# Altium schematic sheet Eurorack_cabletester.schdoc
size 291 x 166 mm
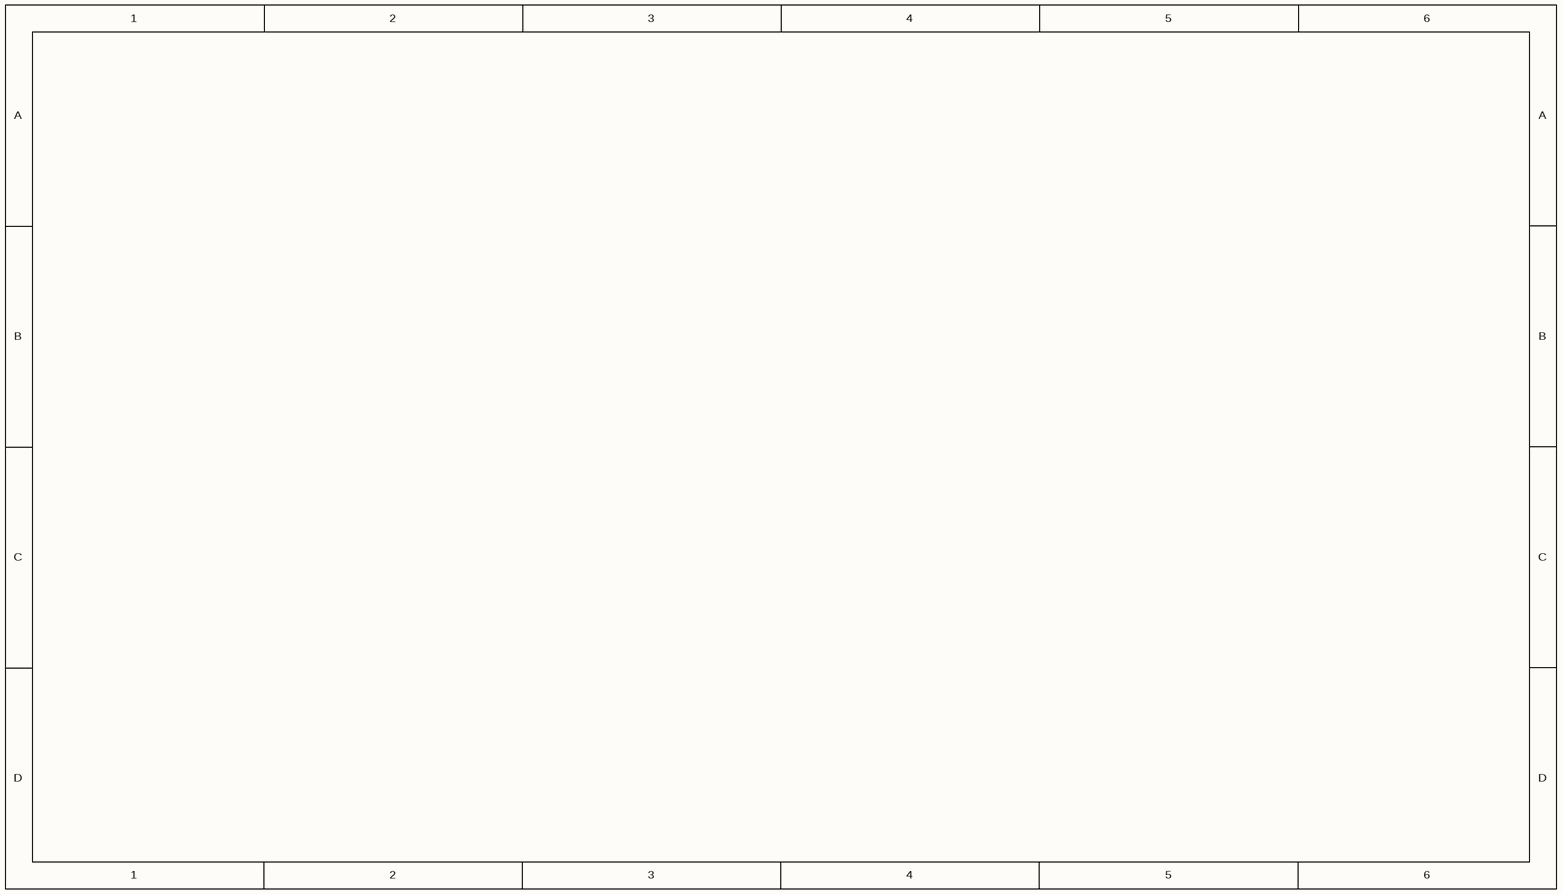
[diagram p0: Eurorack_cabletester.schdoc]

## Parts
C1  100nF  [CAP-TH_L5.0-W2.5-P2.54-D0.7]
CN1  901301116  [CONN-TH_901301116]
CN2  901301116  [CONN-TH_901301116]
R1  1K  [RES-TH_BD2.4-L6.3-P10.30-D0.6]
R2  1K  [RES-TH_BD2.4-L6.3-P10.30-D0.6]
R3  1K  [RES-TH_BD2.4-L6.3-P10.30-D0.6]
R4  1K  [RES-TH_BD2.4-L6.3-P10.30-D0.6]
R5  1K  [RES-TH_BD2.4-L6.3-P10.30-D0.6]
R6  1K  [RES-TH_BD2.4-L6.3-P10.30-D0.6]
R7  1K  [RES-TH_BD2.4-L6.3-P10.30-D0.6]
R8  1K  [RES-TH_BD2.4-L6.3-P10.30-D0.6]
R9  1K  [RES-TH_BD2.4-L6.3-P10.30-D0.6]
R10  10K  [RES-TH_BD2.4-L6.3-P10.30-D0.6]
R11  10K  [RES-TH_BD2.4-L6.3-P10.30-D0.6]
R12  10K  [RES-TH_BD2.4-L6.3-P10.30-D0.6]
R13  10K  [RES-TH_BD2.4-L6.3-P10.30-D0.6]
R14  10K  [RES-TH_BD2.4-L6.3-P10.30-D0.6]
R15  10K  [RES-TH_BD2.4-L6.3-P10.30-D0.6]
R16  10K  [RES-TH_BD2.4-L6.3-P10.30-D0.6]
R17  10K  [RES-TH_BD2.4-L6.3-P10.30-D0.6]
U1  1761608-3  [IDC-TH_10P-P2.54-S2.54_L9.2-W20.3]
U2  ARDUINO_NANO  [COMM-TH_ARDUINO_NANO]
U3  CD4051BE  [DIP-16_L20.0-W6.4-P2.54-LS7.6-BL]
U4  PM254-1-04-Z-8.5  [HDR-TH_4P-P2.54-V-F]
U5  1761608-3  [IDC-TH_10P-P2.54-S2.54_L9.2-W20.3]
U6  New_SchematicLib  [BENS_OLED]

## Ports
GND (in), IO0 (in), IO1 (in), IO2 (in), IO3 (in), IO4 (in), IO5 (in), IO6 (in), IO7 (in), MUX_A (in), MUX_B (in), MUX_C (in), OLED_SCL (in), OLED_SDA (in)

## Nets
+5V: C1.1 R1.2 U2.27(+5V) U3.16(VDD) U4.1 U6.2(Vcc)
GND: C1.2 R9.1 R10.1 R11.1 R12.1 R13.1 R14.1 R15.1 R16.1 R17.1 U2.4(GND) U2.29(GND) U3.6(INH) U3.7(VEE) U3.8(VSS)
GND: U4.2 U6.1(GND) ; port GND  [a separate net that carries the same name]
IO0: CN2.15 CN2.16 R10.2 U3.13(IO0) ; port IO0
IO1: CN2.13 CN2.14 R11.2 U3.14(IO1) ; port IO1
IO2: CN2.11 CN2.12 R12.2 U3.15(IO2) ; port IO2
IO3: CN2.9 CN2.10 R13.2 U3.12(IO3) U5.9 U5.10 ; port IO3
IO4: CN2.7 CN2.8 R14.2 U3.1(IO4) U5.7 U5.8 ; port IO4
IO5: CN2.5 CN2.6 R15.2 U3.5(IO5) U5.5 U5.6 ; port IO5
IO6: CN2.3 CN2.4 R16.2 U3.2(IO6) U5.3 U5.4 ; port IO6
IO7: CN2.1 CN2.2 R17.2 U3.4(IO7) U5.1 U5.2 ; port IO7
MUX_A: U2.6(D3) U3.11(A) ; port MUX_A
MUX_B: U2.7(D4) U3.10(B) ; port MUX_B
MUX_C: U2.8(D5) U3.9(C) ; port MUX_C
net1: CN1.1 CN1.2 R1.1 R2.2 U1.1 U1.2
net2: CN1.3 CN1.4 R2.1 R3.2 U1.3 U1.4
net3: CN1.5 CN1.6 R3.1 R4.2 U1.5 U1.6
net4: CN1.7 CN1.8 R4.1 R5.2 U1.7 U1.8
net5: CN1.9 CN1.10 R5.1 R6.2 U1.9 U1.10
net6: CN1.11 CN1.12 R6.1 R7.2
net7: CN1.13 CN1.14 R7.1 R8.2
net8: CN1.15 CN1.16 R8.1 R9.2
OLED_SCL: U2.24(A5) U4.3 U6.3(SCL) ; port OLED_SCL
OLED_SDA: U2.23(A4) U4.4 U6.4(SDA) ; port OLED_SDA
NetU2_19: U2.19(A0) U3.3(IO)

Not connected (* = marked no-connect by the designer): U2 1(D1/TX)* 2(D0/RX)* 3(RESET)* 5(D2)* 9(D6)* 10(D7)* 11(D8)* 12(D9)* 13(D10)* 14(D11)* 15(D12)* 16(D13)* 17(3V3)* 18(AREF)* 20(A1)* 21(A2)* 22(A3)* 25(A6)* 26(A7)* 28(RESET)* 30(VIN)*

## Notes on the sheet
- (in symbol New_SchematicLib) Bens OLED

## Library data of the parts
C1 = 100nF: BOM_Manufacturer: ReliaPro; BOM_Manufacturer Part: CS1F5.6Y5V1A104Z; nameAlias: Value; BOM_Supplier: LCSC; BOM_Supplier Part: C9306; spicePre: C; spiceSymbolName: CS1F5.6Y5V1A104Z
CN1 CN2 = 901301116: BOM_Manufacturer: MOLEX; Contributor: LCSC; BOM_Supplier: LCSC; BOM_Supplier Part: C505311; BOM_Manufacturer Part: 901301116; BOM_JLCPCB Part Class: Extended Part; spicePre: C; spiceSymbolName: 901301116
R1-R9 = 1K: BOM_Manufacturer: TyoHM; BOM_Manufacturer Part: RN 1/4W 1K F T/B A1; nameAlias: Resistance (Ohms); Contributor: LCSC; Resistance: 1kΩ; BOM_Supplier: LCSC; BOM_Supplier Part: C410696; BOM_JLCPCB Part Class: Extended Part; spicePre: R; spiceSymbolName: RN 1/4W 1K F T/B A1
R10-R17 = 10K: BOM_Manufacturer: TyoHM; BOM_Manufacturer Part: RN 1/4W 1K F T/B A1; nameAlias: Resistance (Ohms); Contributor: LCSC; Resistance: 1kΩ; BOM_Supplier: LCSC; BOM_Supplier Part: C410696; BOM_JLCPCB Part Class: Extended Part; spicePre: R; spiceSymbolName: RN 1/4W 1K F T/B A1
U1 U5 = 1761608-3: BOM_Manufacturer: TE Connectivity; Contributor: LCSC; BOM_Supplier: LCSC; BOM_Supplier Part: C305912; BOM_Manufacturer Part: 1761608-3; spicePre: U; spiceSymbolName: 1761608-3
U2 = ARDUINO_NANO: BOM_Manufacturer: null; Contributor: lcsc; BOM_Supplier: LCSC; BOM_Supplier Part: C9900017879; BOM_Manufacturer Part: ARDUINO_NANO; BOM_JLCPCB Part Class: Extended Part; spicePre: U; spiceSymbolName: ARDUINO_NANO
U3 = CD4051BE: BOM_Manufacturer: TI; spicePre: X; BOM_Supplier: LCSC; BOM_Manufacturer Part: CD4051BE; BOM_Supplier Part: C5200; BOM_JLCPCB Part Class: Extended Part; spiceSymbolName: CD4051BE
U4 = PM254-1-04-Z-8.5: BOM_Manufacturer: HCTL(华灿天禄); Contributor: LCSC; BOM_Supplier: LCSC; BOM_Supplier Part: C2897367; BOM_Manufacturer Part: PM254-1-04-Z-8.5; BOM_JLCPCB Part Class: Extended Part; spicePre: U; spiceSymbolName: PM254-1-04-Z-8.5
U6 = New_SchematicLib: BOM_Manufacturer Part: Q; Contributor: luis.gongod; link: https://benselectronics.nl/oled-i2c-0.96-inch-wit-12864/; spicePre: U; spiceSymbolName: New_SchematicLib